# Altium schematic sheet Mechanical.SchDoc: Mechanical For Geec Power Electronics
size A4; CheckedBy: Conor Farrell; SheetNumber: 6; SheetTotal: 6
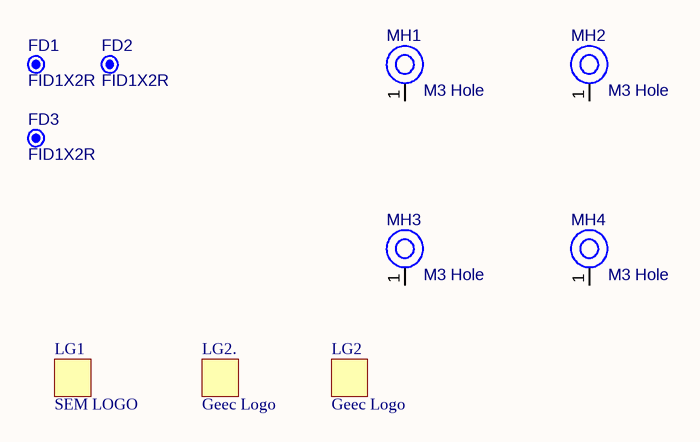
[diagram p0: Mechanical.SchDoc]

## Parts
FD1  FID1X2R  [FID1X2R]  (no BOM)
FD2  FID1X2R  [FID1X2R]  (no BOM)
FD3  FID1X2R  [FID1X2R]  (no BOM)
LG1  SEM LOGO  [SEM LOGO-Footprint-1]  (no BOM)
LG2  Geec Logo  [Geec Logo-Footprint-1]  (no BOM)
LG2.  Geec Logo  [Geec Logo-Footprint-1]  (no BOM)
MH1  M3 Hole  [M3 Hole-Footprint-1]  (no BOM)
MH2  M3 Hole  [M3 Hole-Footprint-1]  (no BOM)
MH3  M3 Hole  [M3 Hole-Footprint-1]  (no BOM)
MH4  M3 Hole  [M3 Hole-Footprint-1]  (no BOM)

## Nets

Not connected (* = marked no-connect by the designer): MH1 1(H1); MH2 1(H1); MH3 1(H1); MH4 1(H1)

## Library data of the parts
FD1-FD3 = CMP-00028-00005-2: Fiducial - Round 1x2mm; Pins: 0
LG1 = CMP-00028-00008-2: SEM Logo Required for Power Electronics
LG2 LG2. = CMP-00028-00009-2
MH1-MH4 = CMP-00028-00007-2: Hole for M3 bolt